# EAGLE design RaspPlaca (EAGLE 8.3.1)
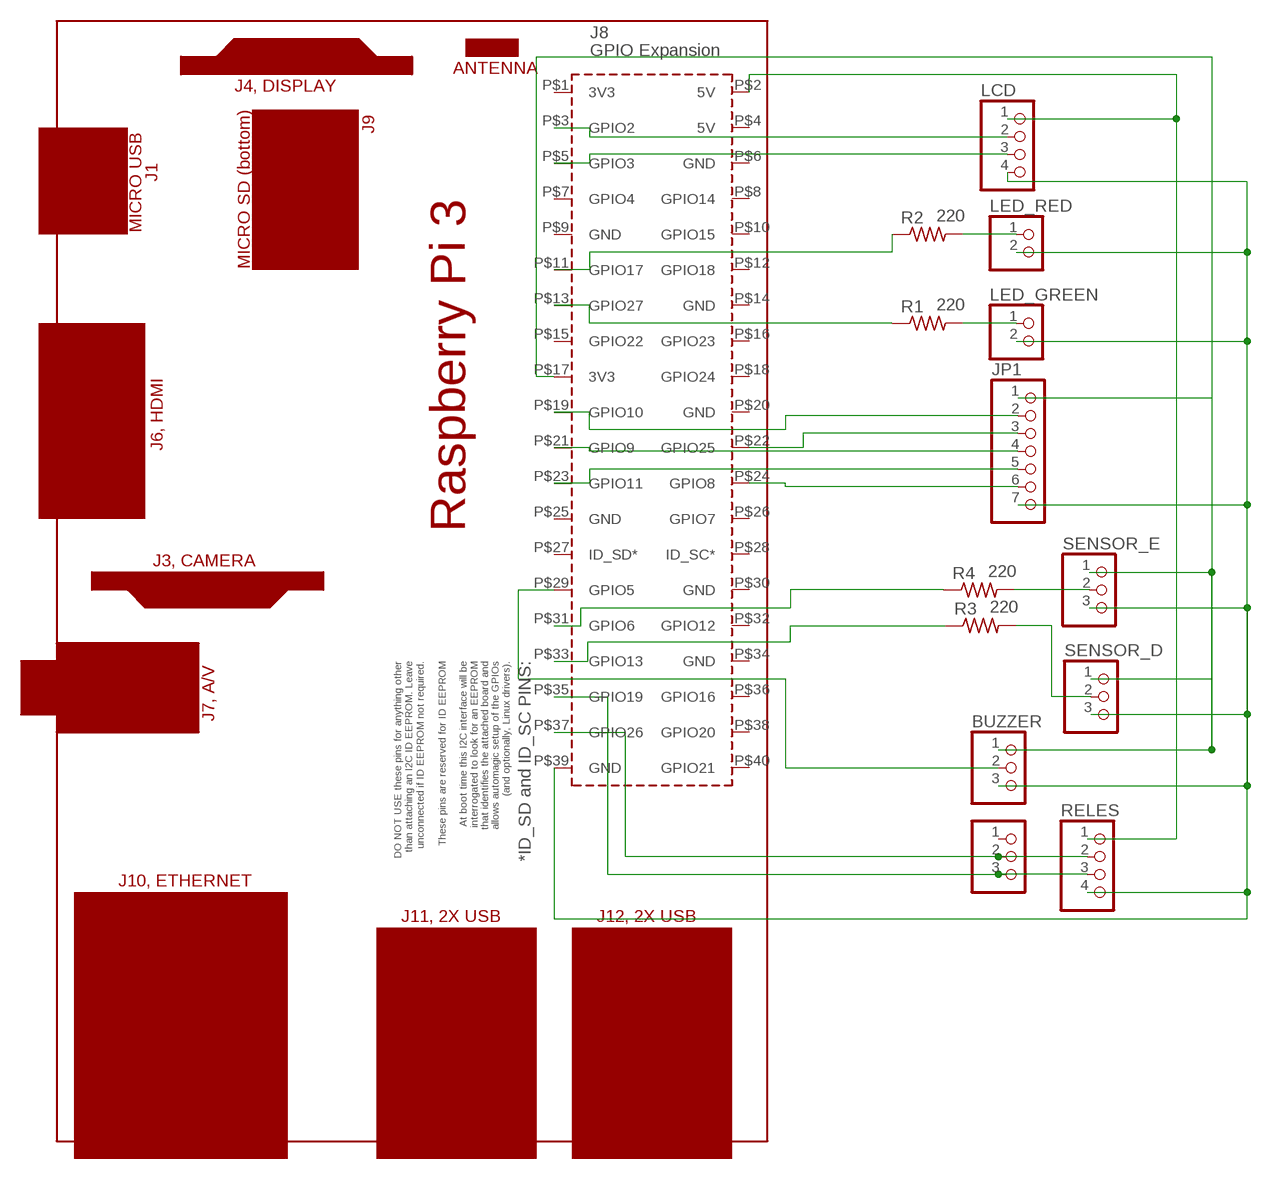
[diagram p0: schematic, sheet 1]

## Parts
BUZZER  PINHD-1X3  [1X03]
JP1  PINHD-1X7  [1X07]
LCD  PINHD-1X4  [1X04]
LED_GREEN  PINHD-1X2  [1X02]
LED_RED  PINHD-1X2  [1X02]
PCB1  RPI3RPI3  [RPI3]
R1  220  R-US_0207/10  [0207/10]
R2  220  R-US_0207/10  [0207/10]
R3  220  R-US_0207/10  [0207/10]
R4  220  R-US_0207/10  [0207/10]
RELES  PINHD-1X4  [1X04]
SENSOR_D  PINHD-1X3  [1X03]
SENSOR_E  PINHD-1X3  [1X03]
UNIFICADOR_RELES  PINHD-1X3  [1X03]

## Nets
3V3: BUZZER.1 JP1.1 PCB1.P$17(3V3) SENSOR_D.1 SENSOR_E.1
5V: LCD.1 PCB1.P$2(5V) RELES.1
GND: BUZZER.3 JP1.7 LCD.4 LED_GREEN.2 LED_RED.2 PCB1.P$39(GND) RELES.4 SENSOR_D.3 SENSOR_E.3
N$1: JP1.3 PCB1.P$22(GPIO25)
N$2: JP1.4 PCB1.P$21(GPIO9)
N$3: JP1.6 PCB1.P$24(GPIO8)
N$4: JP1.5 PCB1.P$23(GPIO11)
N$5: JP1.2 PCB1.P$19(GPIO10)
N$6: PCB1.P$31(GPIO6) R4.1
N$7: BUZZER.2 PCB1.P$29(GPIO5)
N$8: PCB1.P$33(GPIO13) R3.1
N$9: LED_GREEN.1 R1.2
N$10: LED_RED.1 R2.2
N$11: R3.2 SENSOR_D.2
N$12: R4.2 SENSOR_E.2
N$19: PCB1.P$37(GPIO26) RELES.2 UNIFICADOR_RELES.2
N$20: PCB1.P$35(GPIO19) RELES.3 UNIFICADOR_RELES.3
N$23: LCD.2 PCB1.P$3(GPIO2)
N$24: LCD.3 PCB1.P$5(GPIO3)
N$25: PCB1.P$13(GPIO27) R1.1
N$26: PCB1.P$11(GPIO17) R2.1
Unconnected: PCB1.P$1(3V3) PCB1.P$4(5V) PCB1.P$6(GND) PCB1.P$7(GPIO4) PCB1.P$8(GPIO14) PCB1.P$9(GND) PCB1.P$10(GPIO15) PCB1.P$12(GPIO18) PCB1.P$14(GND) PCB1.P$15(GPIO22) PCB1.P$16(GPIO23) PCB1.P$18(GPIO24) PCB1.P$20(GND) PCB1.P$25(GND) PCB1.P$26(GPIO7) PCB1.P$27(ID_SD*) PCB1.P$28(ID_SC*) PCB1.P$30(GND) PCB1.P$32(GPIO12) PCB1.P$34(GND) PCB1.P$36(GPIO16) PCB1.P$38(GPIO20) PCB1.P$40(GPIO21) UNIFICADOR_RELES.1

## Library data of the parts
BUZZER SENSOR_D SENSOR_E UNIFICADOR_RELES = pinhead:PINHD-1X3: PIN HEADER
JP1 = pinhead:PINHD-1X7: PIN HEADER
LCD RELES = pinhead:PINHD-1X4: PIN HEADER
LED_GREEN LED_RED = pinhead:PINHD-1X2: PIN HEADER
PCB1 = e14_Rpi3_RevA+mirror-pcb:RPI3: Device for Raspberry Pi 3 board created by Dave Young for www.element14.com More information and support community is available at https://www.element14.com/community/community/raspberry-pi Device for Raspberry Pi 3 board updated by Gerald Schwarz for www.element14.com On RPI3 addet the layer milling and created a mirrored shield.
R1-R4 = resistor:R-US_: RESISTOR, American symbol

## Board
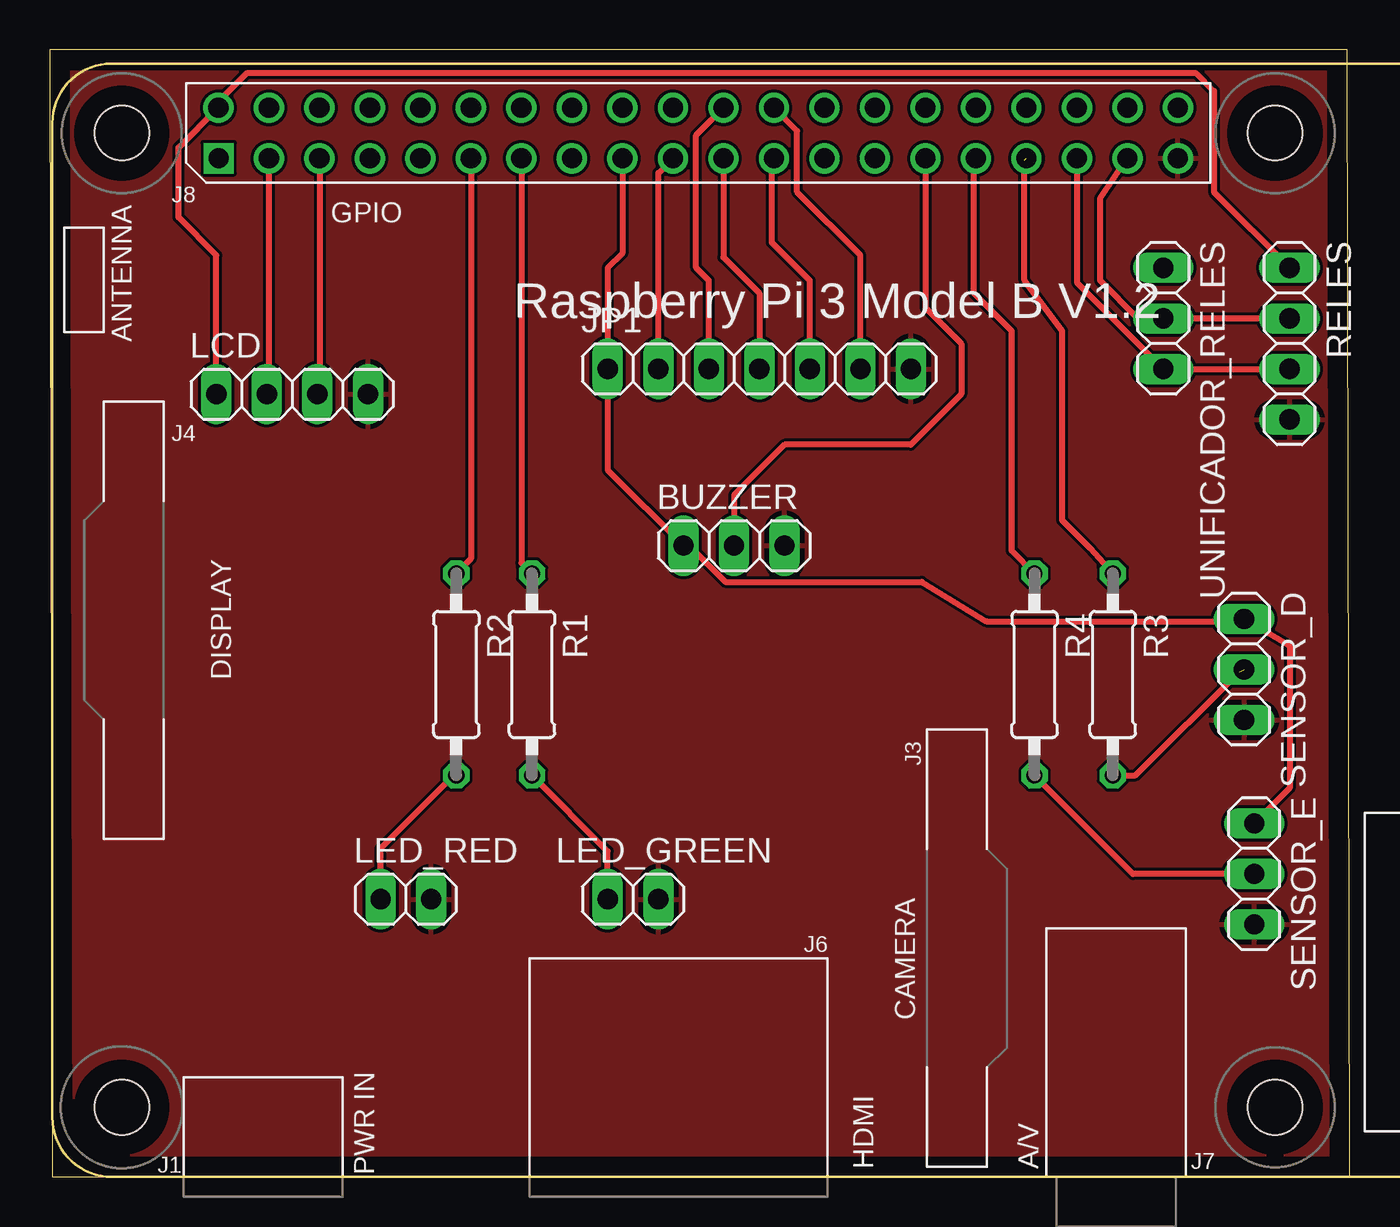
[diagram p1: board, top side]

Size 65.38 x 56.69 mm. Coordinates in mm from the lower left corner, seen from the top.
Outline: 0.13,0 65.38,0 65.26,56.69 0,56.69 0.13,0
Copper layers (1*16): Top 0.035mm / dielectric 1.5mm / Bottom 0.035mm
Design rules "default *": minimum track width 10mil, minimum drill 0.35mm, track to track 6mil, track to pad 6mil, pad to pad 6mil, via to via 6mil, smd to smd 6mil, copper to edge 40mil, drill to drill 6mil, minimum pad ring 10mil, minimum via ring 8mil, stop-mask expansion 4mil, vias tented up to drill 0mil, thermal gap 10mil

### Footprints (pad centres in the part's own frame; a part is rotated, then mirrored left to right if it is on the bottom)
1X03 = drill 1.016 long: 1 -2.54,0; 2 0,0; 3 2.54,0
1X07 = drill 1.016 long: 1 -7.62,0; 2 -5.08,0; 3 -2.54,0; 4 0,0; 5 2.54,0; 6 5.08,0; 7 7.62,0
1X04 = drill 1.016 long: 1 -3.81,0; 2 -1.27,0; 3 1.27,0; 4 3.81,0
1X02 = drill 1.016 long: 1 -1.27,0; 2 1.27,0
RPI3 = drill 1.016 square: P$1 8.37,51.23 | drill 1.016: P$2 8.357,53.772; P$3 10.897,51.232; P$4 10.897,53.772; P$5 13.437,51.232; P$6 13.437,53.772; P$7 15.977,51.232; P$8 15.977,53.772; P$9 18.517,51.232; P$10 18.517,53.772; P$11 21.057,51.232; P$12 21.057,53.772; P$13 23.597,51.232; P$14 23.597,53.772; P$15 26.137,51.232; P$16 26.137,53.772; P$17 28.677,51.232; P$18 28.677,53.772; P$19 31.217,51.232; P$20 31.217,53.772; P$21 33.757,51.232; P$22 33.757,53.772; P$23 36.297,51.232; P$24 36.297,53.772; P$25 38.837,51.232; P$26 38.837,53.772; P$27 41.377,51.232; P$28 41.377,53.772; P$29 43.917,51.232; P$30 43.917,53.772; P$31 46.457,51.232; P$32 46.457,53.772; P$33 48.997,51.232; P$34 48.997,53.772; P$35 51.537,51.232; P$36 51.537,53.772; P$37 54.077,51.232; P$38 54.077,53.772; P$39 56.617,51.232; P$40 56.617,53.772 | hole 2.75: 3.5,3.5; 61.5,3.5; 3.5,52.5; 61.5,52.5
0207/10 = drill 0.813 octagon: 1 -5.08,0; 2 5.08,0

### Placement (x,y rotation side)
BUZZER  34.42,31.75 0 top
JP1  35.69,40.64 0 top
LCD  12.19,39.37 0 top
LED_GREEN  29.34,13.97 0 top
LED_RED  17.91,13.97 0 top
PCB1  0.13,0 0 top
R1  24.26,25.27 270 top
R2  20.45,25.27 270 top
R3  53.47,25.27 270 top
R4  49.53,25.27 270 top
RELES  62.36,41.91 270 top
SENSOR_D  60.07,25.53 270 top
SENSOR_E  60.58,15.24 270 top
UNIFICADOR_RELES  56.01,43.18 270 top

### Tracks (layer width: path | path; a pad name or v marks a point on that pad's centre or on a via)
3V3
  Top 0.305: 60.35,27.9 SENSOR_D.1 | 60.35,27.9 62.23,26.8 62.36,26.67 62.36,19.56 SENSOR_E.1 | 60.35,27.9 60.31,27.94 47.12,27.94 43.87,29.92 33.98,29.92 32.15,31.75 BUZZER.1 28.07,35.56 28.07,40.39 | 28.07,40.39 JP1.1 | PCB1.P$17 28.8,46.46 28.07,45.72 28.07,40.39
5V
  Top 0.305: RELES.1 58.55,49.53 58.55,54.61 57.63,55.52 9.93,55.52 8.48,54.08 PCB1.P$2 6.48,51.77 6.48,48.26 8.38,46.35 LCD.1
GND
  pour Top: 0.13,0 64.9,0 64.9,55.88 0.13,55.88
N$1
  Top 0.305: JP1.3 33.15,45.09 32.51,45.72 32.51,52.4 PCB1.P$22
N$2
  Top 0.305: PCB1.P$21 33.88,46.25 35.69,44.45 JP1.4
N$3
  Top 0.305: JP1.6 40.77,46.35 37.59,49.53 37.59,52.6 PCB1.P$24
N$4
  Top 0.305: JP1.5 38.23,45.09 36.32,46.99 36.32,51.13 PCB1.P$23
N$5
  Top 0.305: JP1.2 30.61,50.49 PCB1.P$19
N$6
  Top 0.305: R4.1 48.39,31.5 48.39,42.55 46.48,44.45 46.48,51.13 PCB1.P$31
N$7
  Top 0.305: PCB1.P$29 44.04,43.71 45.85,41.91 45.85,39.37 43.31,36.83 36.96,36.83 34.42,34.29 BUZZER.2
N$8  (1 unrouted)
  Top 0.305: R3.1 52.32,31.62 50.93,33.02 50.93,42.55 49.02,45.09 49.02,51.13
N$9
  Top 0.305: LED_GREEN.1 28.07,16.38 R1.2
N$10  (1 unrouted)
  Top 0.305: LED_RED.1 16.64,16.51 20.45,20.32
N$11  (1 unrouted)
  Top 0.305: R3.2 54.61,20.19 59.82,25.4
N$12
  Top 0.305: SENSOR_E.2 54.48,15.24 R4.2
N$13
  pour Top: 1.4,54.61 1.4,55.88 63.63,55.88 63.63,54.61
N$14
  pour Top: 1.4,54.61 1.4,55.88 62.36,55.88 63.63,54.61
N$19
  Top 0.305: RELES.2 UNIFICADOR_RELES.2 54.74,43.18 52.83,45.09 52.83,49.23 PCB1.P$37
N$20
  Top 0.305: RELES.3 UNIFICADOR_RELES.3 51.66,44.98 PCB1.P$35
N$23
  Top 0.305: PCB1.P$3 11.02,39.47 LCD.2
N$24
  Top 0.305: PCB1.P$5 13.56,39.47 LCD.3
N$25
  Top 0.305: PCB1.P$13 23.72,30.89 R1.1
N$26
  Top 0.305: PCB1.P$11 21.18,31.09 R2.1